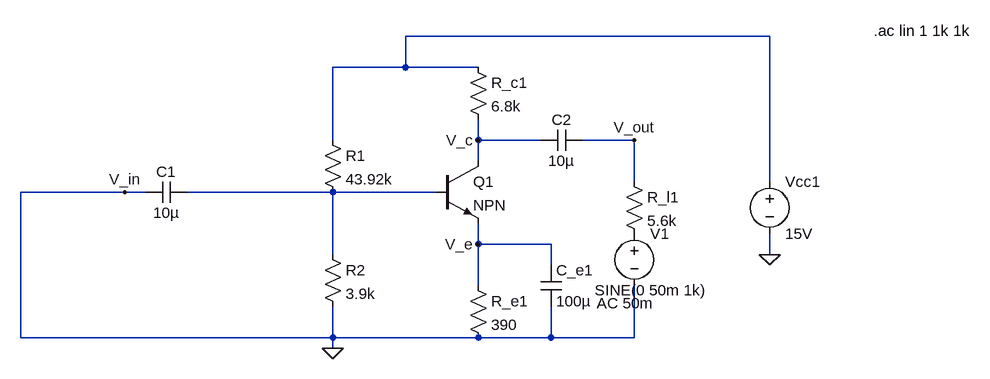
[diagram p0: schematic R_output_Amplifier.asc]
R_output_Amplifier.asc, the LTspice schematic file:
Version 4
SHEET 1 880 680
WIRE 528 -16 -32 -16
WIRE -32 32 -32 -16
WIRE -32 32 -144 32
WIRE 80 32 -32 32
WIRE -144 144 -144 32
WIRE 80 144 80 112
WIRE 176 144 80 144
WIRE 320 144 240 144
WIRE 80 176 80 144
WIRE 320 208 320 144
WIRE 528 208 528 -16
WIRE -464 224 -624 224
WIRE -432 224 -464 224
WIRE -144 224 -368 224
WIRE 16 224 -144 224
WIRE 80 304 80 272
WIRE 192 304 80 304
WIRE -144 320 -144 224
WIRE 528 320 528 288
WIRE 192 336 192 304
WIRE 80 368 80 304
WIRE -624 448 -624 224
WIRE -144 448 -144 400
WIRE -144 448 -624 448
WIRE 80 448 -144 448
WIRE 192 448 192 400
WIRE 192 448 80 448
WIRE 320 448 320 368
WIRE 320 448 192 448
WIRE -144 464 -144 448
FLAG -144 464 0
FLAG 528 320 0
FLAG 80 144 V_c
FLAG 80 304 V_e
FLAG -464 224 V_in
FLAG 320 144 V_out
SYMBOL npn 16 176 R0
SYMATTR InstName Q1
SYMBOL res 64 16 R0
SYMATTR InstName R_c1
SYMATTR Value 6.8k
SYMBOL res -160 128 R0
SYMATTR InstName R1
SYMATTR Value 43.92k
SYMBOL res -160 304 R0
SYMATTR InstName R2
SYMATTR Value 3.9k
SYMBOL res 64 352 R0
SYMATTR InstName R_e1
SYMATTR Value 390
SYMBOL res 304 192 R0
SYMATTR InstName R_l1
SYMATTR Value 5.6k
SYMBOL cap -368 208 R90
WINDOW 0 0 32 VBottom 2
WINDOW 3 32 32 VTop 2
SYMATTR InstName C1
SYMATTR Value 10µ
SYMBOL cap 176 160 R270
WINDOW 0 32 32 VTop 2
WINDOW 3 0 32 VBottom 2
SYMATTR InstName C2
SYMATTR Value 10µ
SYMBOL voltage 528 192 R0
WINDOW 123 0 0 Left 0
WINDOW 39 0 0 Left 0
SYMATTR InstName Vcc1
SYMATTR Value 15V
SYMBOL cap 176 336 R0
SYMATTR InstName C_e1
SYMATTR Value 100µ
SYMBOL voltage 320 272 R0
WINDOW 3 -61 103 Left 2
WINDOW 123 -58 123 Left 2
WINDOW 39 0 0 Left 0
SYMATTR Value SINE(0 50m 1k)
SYMATTR Value2 AC 50m
SYMATTR InstName V1
TEXT 688 -24 Left 2 !.ac lin 1 1k 1k

The netlist it stands for:
* R_output_Amplifier.asc
Q1 V_c N002 V_e 0 NPN
R_c1 N001 V_c 6.8k
R1 N001 N002 43.92k
R2 N002 0 3.9k
R_e1 V_e 0 390
R_l1 V_out P001 5.6k
C1 N002 0 10µ
C2 V_c V_out 10µ
Vcc1 N001 0 15V
C_e1 V_e 0 100µ
V1 P001 0 SINE(0 50m 1k) AC 50m
.model NPN NPN
.model PNP PNP
.lib standard.bjt
.ac lin 1 1k 1k
.backanno
.end